# EAGLE design auxboxshield1.58 (EAGLE 6.5.0)
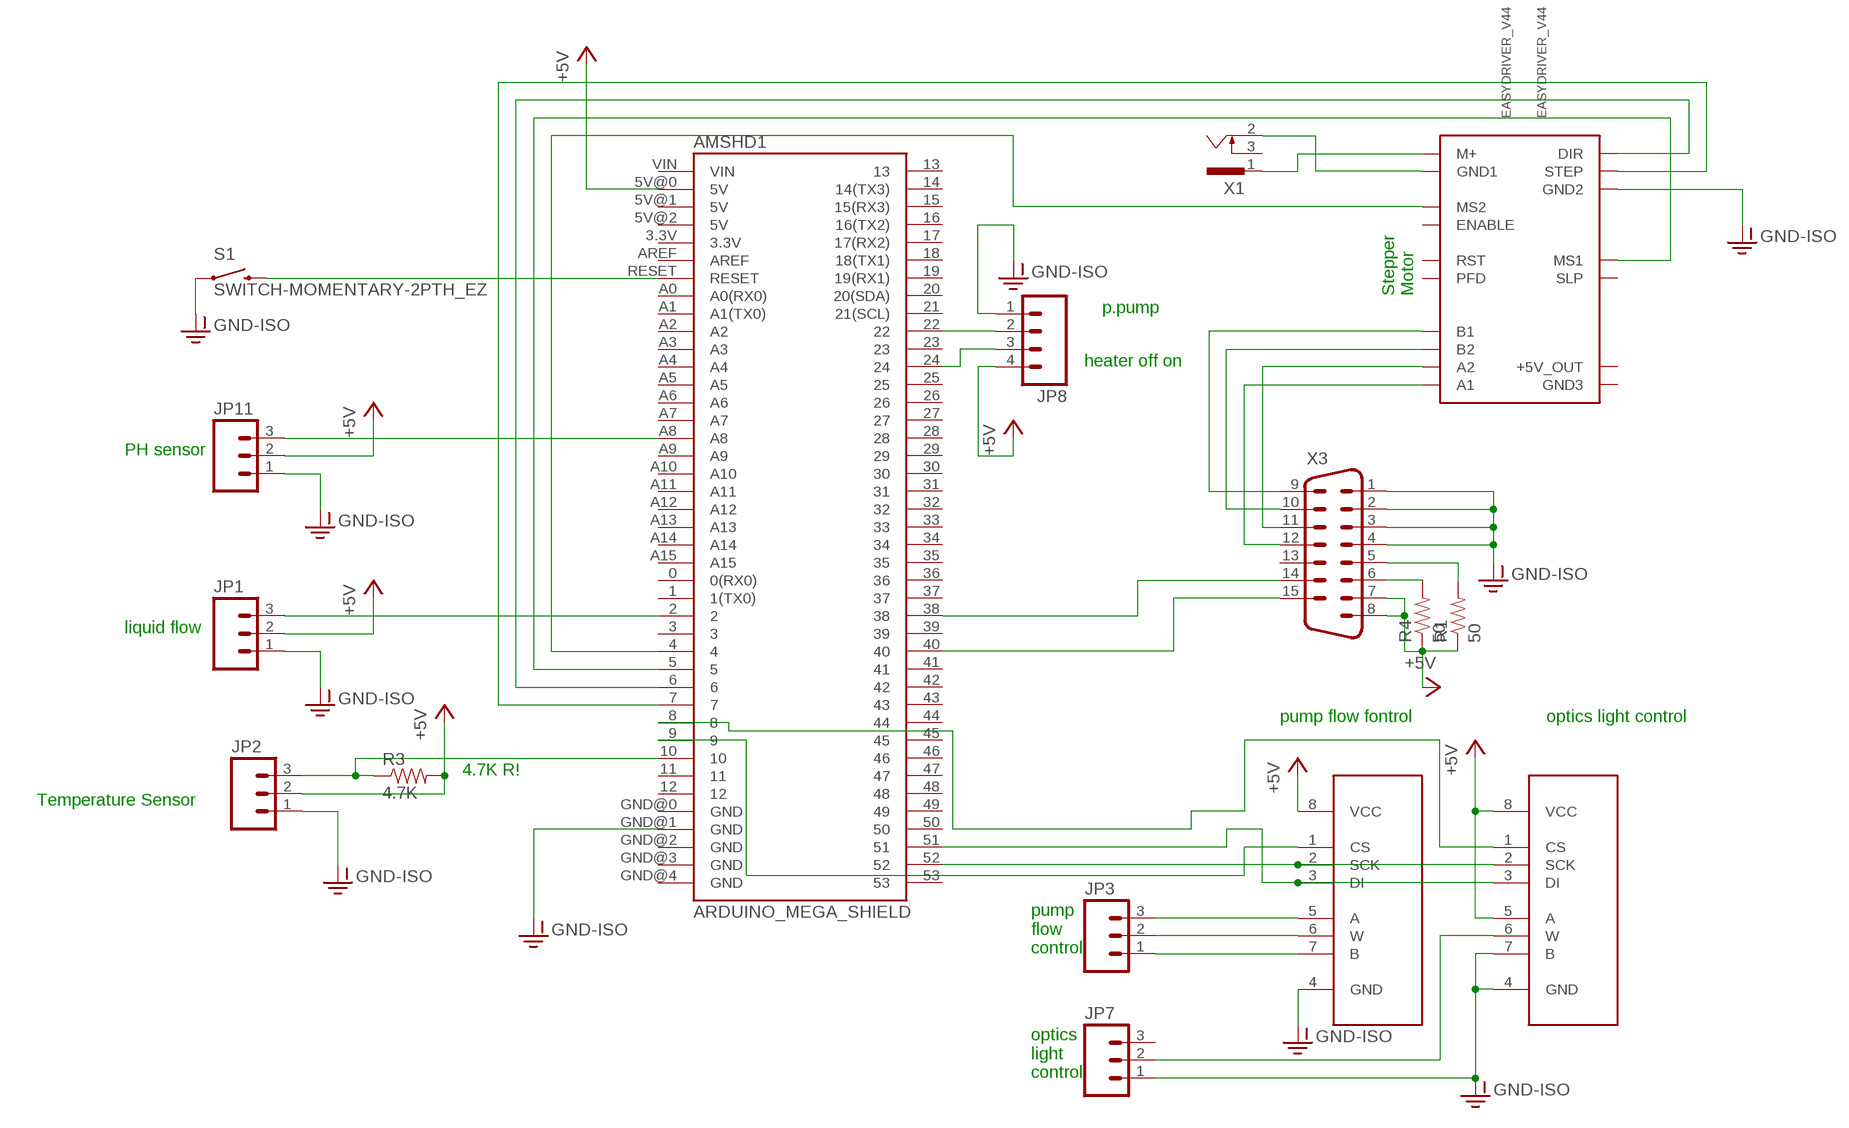
[diagram p0: schematic, sheet 1]

## Parts
AMSHD1  ARDUINO_MEGA_SHIELD  [ARDUINO_MEGA_SHIELD]
EASYDRIVER_V44  EASYDRIVER_V44  [EASYDRIVER_V44]
JP1  M03POLAR  [MOLEX-1X3]
JP2  M03POLAR  [MOLEX-1X3]
JP3  M03POLAR  [MOLEX-1X3]
JP7  M03POLAR  [MOLEX-1X3]
JP8  M04POLAR  [MOLEX-1X4]
JP11  M03POLAR  [MOLEX-1X3]
R1  50  10OHM-1/4W-5%(PTH)  [AXIAL-0.3]
R3  4.7K  10OHM-1/4W-5%(PTH)  [AXIAL-0.3]
R4  50  10OHM-1/4W-5%(PTH)  [AXIAL-0.3]
S1  SWITCH-MOMENTARY-2PTH_EZ  [TACTILE-PTH-EZ]
U1  MCP41XXXDIL  [DIL-08]
U2  MCP41XXXDIL  [DIL-08]
X1  SCD-014A  [SCD-014-A]
X3  M15V  [M15V]

## Nets
+5V: AMSHD1.5V@0(5V) JP1.2 JP2.2 JP8.4 JP11.2 R1.P$1 R3.P$2 R4.P$1 U1.5(A) U1.8(VCC) U2.8(VCC) X3.7 X3.8
GND-ISO: AMSHD1.GND@1(GND) EASYDRIVER_V44.GND2 JP1.1 JP2.1 JP7.1 JP8.1 JP11.1 S1.1 U1.4(GND) U1.7(B) U2.4(GND) X3.1 X3.2 X3.3 X3.4
N$1: EASYDRIVER_V44.M+ X1.1
N$3: AMSHD1.38 X3.14
N$4: R1.P$2 X3.5
N$6: EASYDRIVER_V44.GND1 X1.2
N$7: EASYDRIVER_V44.A1 X3.12
N$9: AMSHD1.RESET S1.3
N$11: EASYDRIVER_V44.A2 X3.11
N$12: AMSHD1.9 U2.1(CS)
N$13: AMSHD1.5 EASYDRIVER_V44.MS1
N$14: AMSHD1.22 JP8.2
N$15: AMSHD1.A8 JP11.3
N$16: AMSHD1.4 EASYDRIVER_V44.MS2
N$17: AMSHD1.52 U1.2(SCK) U2.2(SCK)
N$18: AMSHD1.24 JP8.3
N$19: AMSHD1.40 X3.15
N$20: AMSHD1.51 U1.3(DI) U2.3(DI)
N$21: JP3.3 U2.5(A)
N$24: JP3.2 U2.6(W)
N$26: AMSHD1.10 JP2.3 R3.P$1
N$27: EASYDRIVER_V44.B2 X3.10
N$28: AMSHD1.2 JP1.3
N$29: AMSHD1.6 EASYDRIVER_V44.DIR
N$30: AMSHD1.7 EASYDRIVER_V44.STEP
N$31: EASYDRIVER_V44.B1 X3.9
N$32: JP3.1 U2.7(B)
N$33: R4.P$2 X3.6
N$34: AMSHD1.8 U1.1(CS)
N$35: JP7.2 U1.6(W)
Unconnected: AMSHD1.0(0(RX0)) AMSHD1.1(1(TX0)) AMSHD1.3 AMSHD1.3.3V AMSHD1.5V@1(5V) AMSHD1.5V@2(5V) AMSHD1.11 AMSHD1.12 AMSHD1.13 AMSHD1.14(14(TX3)) AMSHD1.15(15(RX3)) AMSHD1.16(16(TX2)) AMSHD1.17(17(RX2)) AMSHD1.18(18(TX1)) AMSHD1.19(19(RX1)) AMSHD1.20(20(SDA)) AMSHD1.21(21(SCL)) AMSHD1.23 AMSHD1.25 AMSHD1.26 AMSHD1.27 AMSHD1.28 AMSHD1.29 AMSHD1.30 AMSHD1.31 AMSHD1.32 AMSHD1.33 AMSHD1.34 AMSHD1.35 AMSHD1.36 AMSHD1.37 AMSHD1.39 AMSHD1.41 AMSHD1.42 AMSHD1.43 AMSHD1.44 AMSHD1.45 AMSHD1.46 AMSHD1.47 AMSHD1.48 AMSHD1.49 AMSHD1.50 AMSHD1.53 AMSHD1.A0(A0(RX0)) AMSHD1.A1(A1(TX0)) AMSHD1.A2 AMSHD1.A3 AMSHD1.A4 AMSHD1.A5 AMSHD1.A6 AMSHD1.A7 AMSHD1.A9 AMSHD1.A10 AMSHD1.A11 AMSHD1.A12 AMSHD1.A13 AMSHD1.A14 AMSHD1.A15 AMSHD1.AREF AMSHD1.GND@0(GND) AMSHD1.GND@2(GND) AMSHD1.GND@3(GND) AMSHD1.GND@4(GND) AMSHD1.VIN EASYDRIVER_V44.ENABLE EASYDRIVER_V44.GND3 EASYDRIVER_V44.P$11(+5V_OUT) EASYDRIVER_V44.PFD EASYDRIVER_V44.RST EASYDRIVER_V44.SLEEP(SLP) JP7.3 X1.3 X3.13

## Notes on the sheet
- Stepper
  Motor
- p.pump
- heater off on
- PH sensor
- liquid flow
- pump flow fontrol | optics light control
- 4.7K R!
- Temperature Sensor
- pump 
  flow
  control
- optics
  light 
  control

## Library data of the parts
AMSHD1 = SparkFun-Boards:ARDUINO_MEGA_SHIELD
EASYDRIVER_V44 = EasyDriver:EASYDRIVER_V44: EasyDriver version 4.4 - http://www.schmalzhaus.com/EasyDriver
JP1-JP3 JP7 JP11 = SparkFun-Connectors:M03: Header 3 Standard 3-pin 0.1" header. Use with straight break away headers (SKU : PRT-00116), right angle break away headers (PRT-00553), swiss pins (PRT-00743), machine pins (PRT-00117), and female headers (PRT-00115). Molex polarized connector foot print use with SKU : PRT-08232 with associated crimp pins and housings.
JP8 = SparkFun-Connectors:M04: Header 4 Standard 4-pin 0.1" header. Use with straight break away headers (SKU : PRT-00116), right angle break away headers (PRT-00553), swiss pins (PRT-00743), machine pins (PRT-00117), and female headers (PRT-00115). Molex polarized connector foot print use with SKU : PRT-08231 with associated crimp pins and housings. 1MM SMD Version SKU: PRT-10208
R1 R3 R4 = SparkFun-Resistors:10OHM-1/4W-5%(PTH): RES-10698; PROD_ID: RES-10698; VALUE: 10
S1 = SparkFun-Electromechanical:SWITCH-MOMENTARY-2: Various NO switches- pushbuttons, reed, etc
U1 U2 = SparkFun-AnalogIC:MCP41XXX: SPI controlled single digital potentiometer by Microchip PID: COM-10613
X1 = con-shiua-chyuan:SCD-014A: Power Jack 2.5mm; OC_FARNELL: unknown; OC_NEWARK: unknown
X3 = con-subd:M15: SUB-D; OC_FARNELL: unknown; OC_NEWARK: unknown

## Board
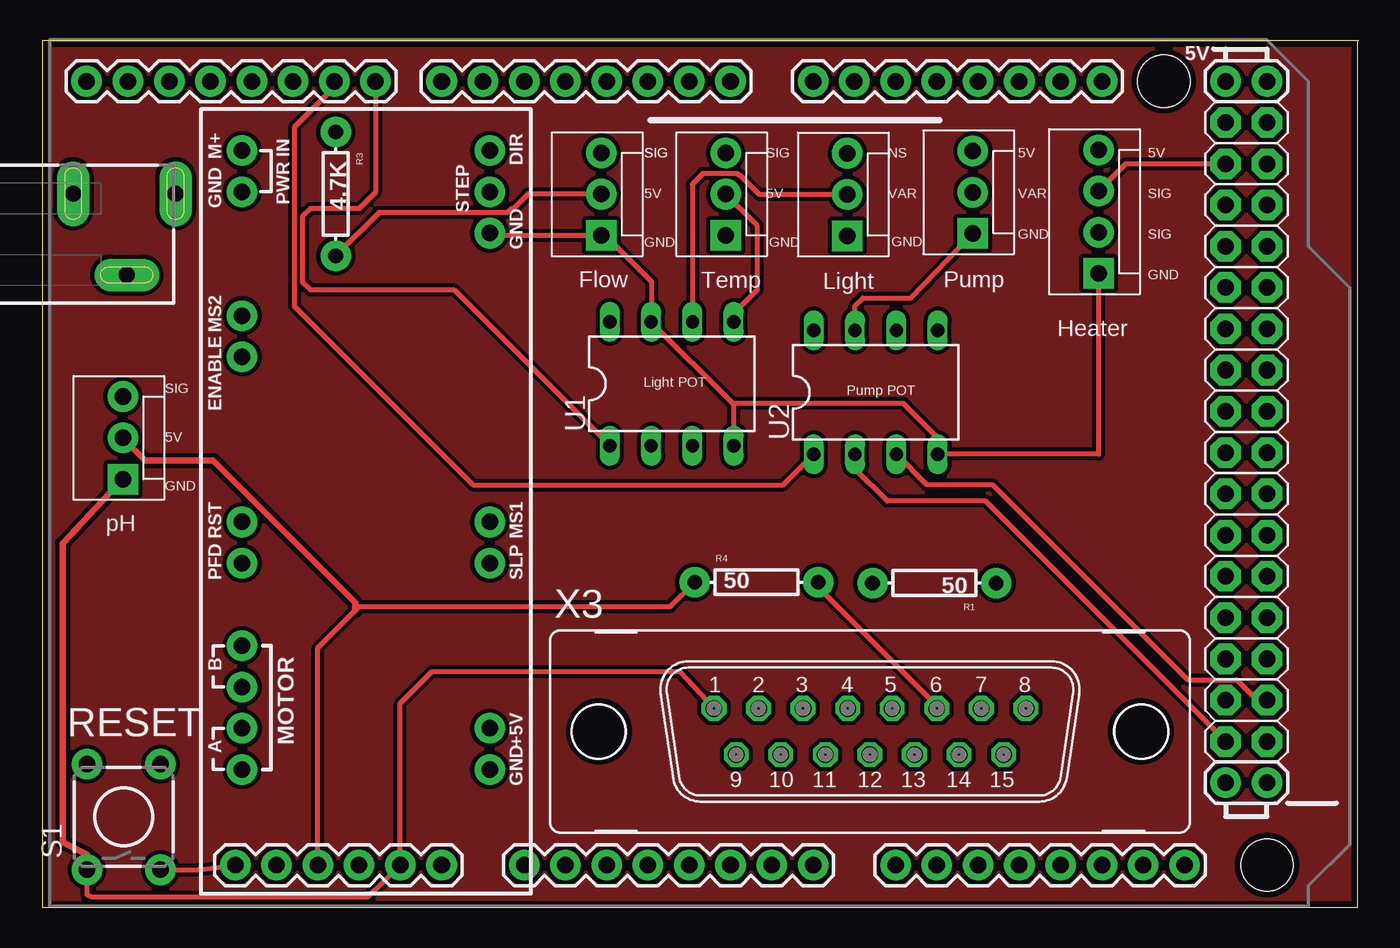
[diagram p1: board, top side]
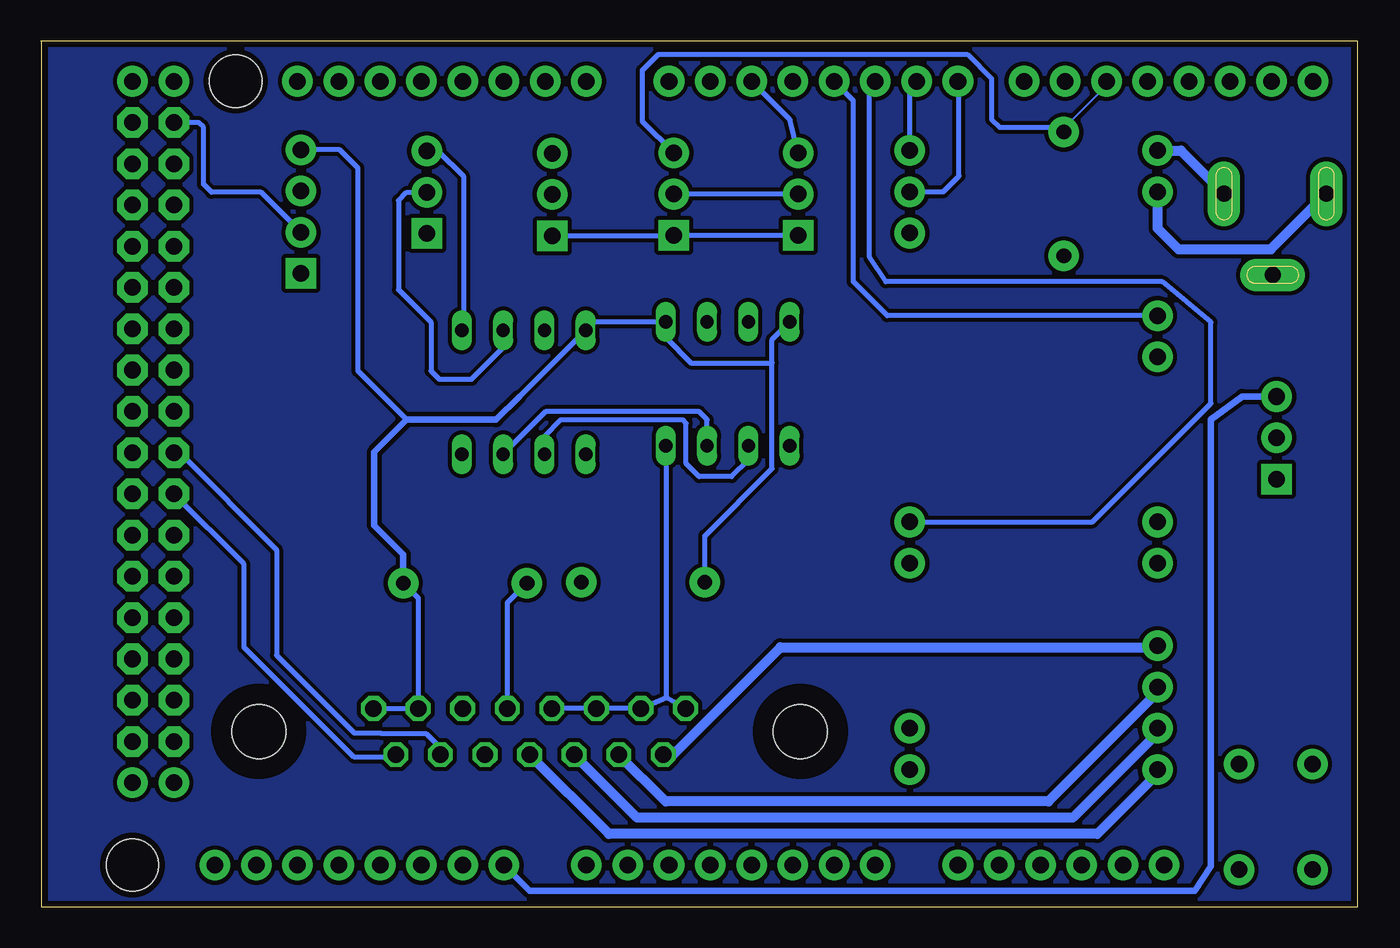
[diagram p2: board, bottom side, seen from below]

Size 81.03 x 53.34 mm. Coordinates in mm from the lower left corner, seen from the top.
Outline: 80.95,53.33 80.95,0 0,0 0,53.33
Outline: 81.03,53.34 0,53.34
Copper layers (1*16): Top 0.0356mm / dielectric 1.5011mm / Bottom 0.0356mm
Design rules "LaenPCBOrder (1)": minimum track width 6mil, minimum drill 13mil, track to track 6mil, track to pad 6mil, pad to pad 6mil, via to via 6mil, smd to smd 6mil, copper to edge 15mil, drill to drill 6mil, minimum pad ring 7mil, minimum via ring 7mil, stop-mask expansion 3mil, vias tented up to drill 0mil, thermal gap 10mil

### Footprints (pad centres in the part's own frame; a part is rotated, then mirrored left to right if it is on the bottom)
ARDUINO_MEGA_SHIELD = drill 1.016 pad 1.88: 0 19.05,27.94; 1 16.51,27.94; 2 13.97,27.94; 3 11.43,27.94; 3.3V -8.89,-20.32; 4 8.89,27.94; 5 6.35,27.94; 5V@0 -6.35,-20.32; 5V@1 49.53,27.94; 5V@2 52.07,27.94; 6 3.81,27.94; 7 1.27,27.94; 8 -2.794,27.94; 9 -5.334,27.94; 10 -7.874,27.94; 11 -10.414,27.94; 12 -12.954,27.94; 13 -15.494,27.94; 14 24.13,27.94; 15 26.67,27.94; 16 29.21,27.94; 17 31.75,27.94; 18 34.29,27.94; 19 36.83,27.94; 20 39.37,27.94; 21 41.91,27.94; A0 6.35,-20.32; A1 8.89,-20.32; A2 11.43,-20.32; A3 13.97,-20.32; A4 16.51,-20.32; A5 19.05,-20.32; A6 21.59,-20.32; A7 24.13,-20.32; A8 29.21,-20.32; A9 31.75,-20.32; A10 34.29,-20.32; A11 36.83,-20.32; A12 39.37,-20.32; A13 41.91,-20.32; A14 44.45,-20.32; A15 46.99,-20.32; AREF -20.574,27.94; GND@0 -3.81,-20.32; GND@1 -1.27,-20.32; GND@2 49.53,-15.24; GND@3 52.07,-15.24; GND@4 -18.034,27.94; RESET -11.43,-20.32; VIN 1.27,-20.32 | drill 1.016 pad 1.88 octagon: 22 49.53,25.4; 23 52.07,25.4; 24 49.53,22.86; 25 52.07,22.86; 26 49.53,20.32; 27 52.07,20.32; 28 49.53,17.78; 29 52.07,17.78; 30 49.53,15.24; 31 52.07,15.24; 32 49.53,12.7; 33 52.07,12.7; 34 49.53,10.16; 35 52.07,10.16; 36 49.53,7.62; 37 52.07,7.62; 38 49.53,5.08; 39 52.07,5.08; 40 49.53,2.54; 41 52.07,2.54; 42 49.53,0; 43 52.07,0; 44 49.53,-2.54; 45 52.07,-2.54; 46 49.53,-5.08; 47 52.07,-5.08; 48 49.53,-7.62; 49 52.07,-7.62; 50 49.53,-10.16; 51 52.07,-10.16; 52 49.53,-12.7; 53 52.07,-12.7 | hole 3.2: 45.72,27.94; 52.07,-20.32
EASYDRIVER_V44 = drill 1.016 pad 1.88: A1 -16.51,7.62; A2 -13.97,7.62; B1 -8.89,7.62; B2 -11.43,7.62; DIR 21.59,-7.62; ENABLE 8.89,7.62; GND1 19.05,7.62; GND2 16.51,-7.62; GND3 -16.51,-7.62; M+ 21.59,7.62; MS1 -1.27,-7.62; MS2 11.43,7.62; P$11 -13.97,-7.62; PFD -3.81,7.62; RST -1.27,7.62; SLEEP -3.81,-7.62; STEP 19.05,-7.62
MOLEX-1X3 = drill 1.016 pad 1.88 square: 1 0,0 | drill 1.016 pad 1.88: 2 2.54,0; 3 5.08,0
MOLEX-1X4 = drill 1.016 pad 1.88 square: 1 0,0 | drill 1.016 pad 1.88: 2 2.54,0; 3 5.08,0; 4 7.62,0
AXIAL-0.3 = drill 0.9 pad 1.88: P$1 -3.81,0; P$2 3.81,0
TACTILE-PTH-EZ = drill 1.016 pad 1.88: 1 -3.251,2.261; 2 3.251,2.261; 3 -3.251,-2.261; 4 3.251,-2.261
DIL-08 = drill 0.813 long: 1 -3.81,-3.81; 2 -1.27,-3.81; 3 1.27,-3.81; 4 3.81,-3.81; 5 3.81,3.81; 6 1.27,3.81; 7 -1.27,3.81; 8 -3.81,3.81
SCD-014-A = drill 1 pad 2 long: 1 -2.5,13.8; 2 -2.5,7.5; 3 2.5,10.8
M15V = drill 1.016 octagon: 1 -9.601,1.422; 2 -6.858,1.422; 3 -4.115,1.422; 4 -1.372,1.422; 5 1.372,1.422; 6 4.115,1.422; 7 6.858,1.422; 8 9.601,1.422; 9 -8.23,-1.422; 10 -5.486,-1.422; 11 -2.743,-1.422; 12 0,-1.422; 13 2.743,-1.422; 14 5.486,-1.422; 15 8.23,-1.422 | hole 3.302: 16.662,0; -16.662,0

### Placement (x,y rotation side)
AMSHD1  23.3,22.9 0 top
EASYDRIVER_V44  19.91,24.98 90 top
JP1  34.4,41.35 90 top
JP2  42.05,41.35 90 top
JP3  57.26,41.47 90 top
JP7  49.54,41.33 90 top
JP8  65,39 90 top
JP11  4.95,26.35 90 top
R1  54.9,19.95 180 top
R3  18.05,43.9 270 top
R4  43.95,20 0 top
S1  5,5.55 90 top
U1  38.73,32.22 0 top
U2  51.29,31.69 0 top
X1  -5.61,41.42 270 top
X3  50.93,10.81 0 top

### Tracks (layer width: path | path; a pad name or v marks a point on that pad's centre or on a via)
+5V
  Top 0.305: AMSHD1.5V@0 16.95,15.95 19.25,18.25 19.5,18.5 38.64,18.5 R4.P$1 | U1.5 42.55,36.55 44,38 44,41.94 JP2.2 | JP1.2 29.89,43.89 29,43 28.88,43 28.64,42.76 20.72,42.76 R3.P$2
  Top 0.406: JP11.2 6.34,27.5 10.5,27.5 19.25,18.75 19.25,18.25
  Bottom 0.305: 51.59,31.39 U2.8 46.95,36.02 U1.5 42.55,35.05 41,33.5 36,33.5 | JP1.2 JP2.2 | R4.P$1 40.14,22.86 36,27 36,33.5 | 36,33.5 36,34.95 U1.8 | X3.8 X3.7 57.79,19.03 R1.P$1 | 58.5,30 61.5,33 61.5,45.5 62.62,46.62 JP8.4
  Bottom 0.406: R1.P$1 58.71,21.71 60.5,23.5 60.5,28 58.5,30 52.98,30 51.59,31.39
GND
  pour Bottom (isolate 0.254): 0,53.5 81,53.5 81,0 0,0
GND-ISO
  Top 0.305: EASYDRIVER_V44.GND2 27.67,41.35 JP1.1 34.9,41.1 37.5,38.5 37.5,36.06 U1.7 42.49,31 | S1.1 2.74,0.76 3.06,0.62 20.01,0.62 AMSHD1.GND@1 22.03,12.53 24,14.5 39.22,14.5 X3.1 | 42.5,28.36 U1.4 42.55,30.95 42.49,31 | 42.49,31 53,31 55.1,28.9 U2.4 65,27.88 JP8.1
  Top 0.406: JP11.1 1.25,22.4 1.25,4 2.74,3.26 S1.1
  Bottom 0.305: JP7.1 42.07,41.33 JP2.1 JP1.1 | 42.5,12.92 42.5,28.36 U1.4 | 42.5,12.92 X3.1 | X3.4 X3.3 X3.2 42.5,12.92
N$1
  Bottom 0.61: EASYDRIVER_V44.M+ 10.84,46.57 X1.1
N$3
  Bottom 0.305: AMSHD1.38 72.48,27.98 66.5,22 66.5,15.5 61.72,10.72 60.09,10.72 60.06,10.69 57.31,10.69 56.42,9.8 X3.14
N$4
  Bottom 0.305: R1.P$2 52.3,18.74 X3.5
N$6
  Bottom 0.61: EASYDRIVER_V44.GND1 12.29,41.79 11,40.5 5.31,40.5 X1.2
N$7
  Bottom 0.61: EASYDRIVER_V44.A1 12.29,8.21 16,4.5 46.05,4.5 X3.12
N$8
  pour Top (isolate 0.254): 0.5,53 80.5,53 80.5,0.5 0.5,0.5
N$9
  Top 0.305: S1.3 9.59,2.3 AMSHD1.RESET
N$11
  Bottom 0.61: EASYDRIVER_V44.A2 12.29,10.71 17.5,5.5 44.3,5.5 X3.11
N$12
  Top 0.305: AMSHD1.9 17.97,50.47 15.5,48 15.5,37 26.5,26 45.59,26 U2.1
N$13
  Bottom 0.305: EASYDRIVER_V44.MS1 16.29,23.71 9,31 9,36 12,38.5 29,38.5 30,40 30,50.49 AMSHD1.5
N$14
  Bottom 0.305: JP8.2 67.46,44 70.5,44 71,44.5 71,48 71.3,48.3 AMSHD1.22
N$15
  Bottom 0.406: AMSHD1.A8 50.93,1 10,1 9,2.5 9,30 7.07,31.43 JP11.3
N$16
  Bottom 0.305: EASYDRIVER_V44.MS2 28.91,36.41 31,38.5 31,49.65 AMSHD1.4
N$17
  Top 0.305: AMSHD1.52 58.03,25 52,25 50.02,26.98 U2.2
  Bottom 0.305: U1.2 37.47,27.54 38.5,26.5 40.5,26.5 41,27 41,27.01 41.3,27.31 41.3,29.8 41.5,30 49,30 50.02,28.98 U2.2
N$18
  Top 0.305: JP8.3 66.68,45.76 AMSHD1.24
N$19
  Bottom 0.305: AMSHD1.40 68.5,21.11 68.5,16 61.73,9.23 59.32,9.23 X3.15
N$20
  Top 0.305: AMSHD1.51 74.76,12.74 73.5,14 70.5,14 58.5,26 54.44,26 U2.3
  Bottom 0.305: U1.3 40.01,30 40.5,30.5 49.94,30.5 U2.3
N$21
  Bottom 0.305: JP3.3 56.58,46.58 55,45 55,35.6 U2.5
N$24
  Top 0.305: U2.6 52.56,34.73
  Bottom 0.305: U2.6 52.56,34.44 54.5,32.5 56.5,32.5 57,33 57,36 59,38 59,43.5 58.49,44.01 JP3.2
N$26
  Bottom 0.152: AMSHD1.10 15,51 18,48 R3.P$1
  Bottom 0.305: R3.P$1 18.34,48 22,48 22.5,48.5 22.5,51 24,52.5 43,52.5 44,51.5 44,48.38 JP2.3
N$27
  Bottom 0.61: EASYDRIVER_V44.B2 12.29,13.21 19,6.5 42.56,6.5 X3.10
N$28
  Bottom 0.305: JP1.3 34.9,48.47 AMSHD1.2
N$29
  Bottom 0.305: EASYDRIVER_V44.DIR 27.53,50.42 AMSHD1.6
N$30
  Bottom 0.305: EASYDRIVER_V44.STEP 25.47,44.03 24.5,45 24.5,50.5 24,51 24.41,51 AMSHD1.7
N$31
  Bottom 0.61: X3.9 42.12,9.38 35.5,16 13,16 EASYDRIVER_V44.B1
N$32
  Top 0.305: U2.7 50.02,37.02 50.5,37.5 53.45,37.5 JP3.1
N$33
  Top 0.305: X3.6 55.05,12.39 47.76,19.68 R4.P$2
N$34
  Top 0.305: AMSHD1.8 20.51,44.01 19.5,43 16.5,43 16,42.5 16,38.5 16.5,38 25.33,38 U1.1
N$35
  Top 0.305: JP7.2 44.13,43.87 43,45 42.94,45 42.78,45.16 40.66,45.16 40,44.5 U1.6

### Text on the board
tPlace: SIG | SIG | SIG | NS | 5V | 5V | 5V | 5V | VAR | VAR | SIG | GND | GND | GND | GND | SIG | GND | Flow | Temp | Light | Pump | Heater | SIG | Light POT | Pump POT | 5V | GND | pH | RESET
DrillLegend_01-16: 01-16